# Altium schematic sheet [04] - ETHERNET.SchDoc
size A2
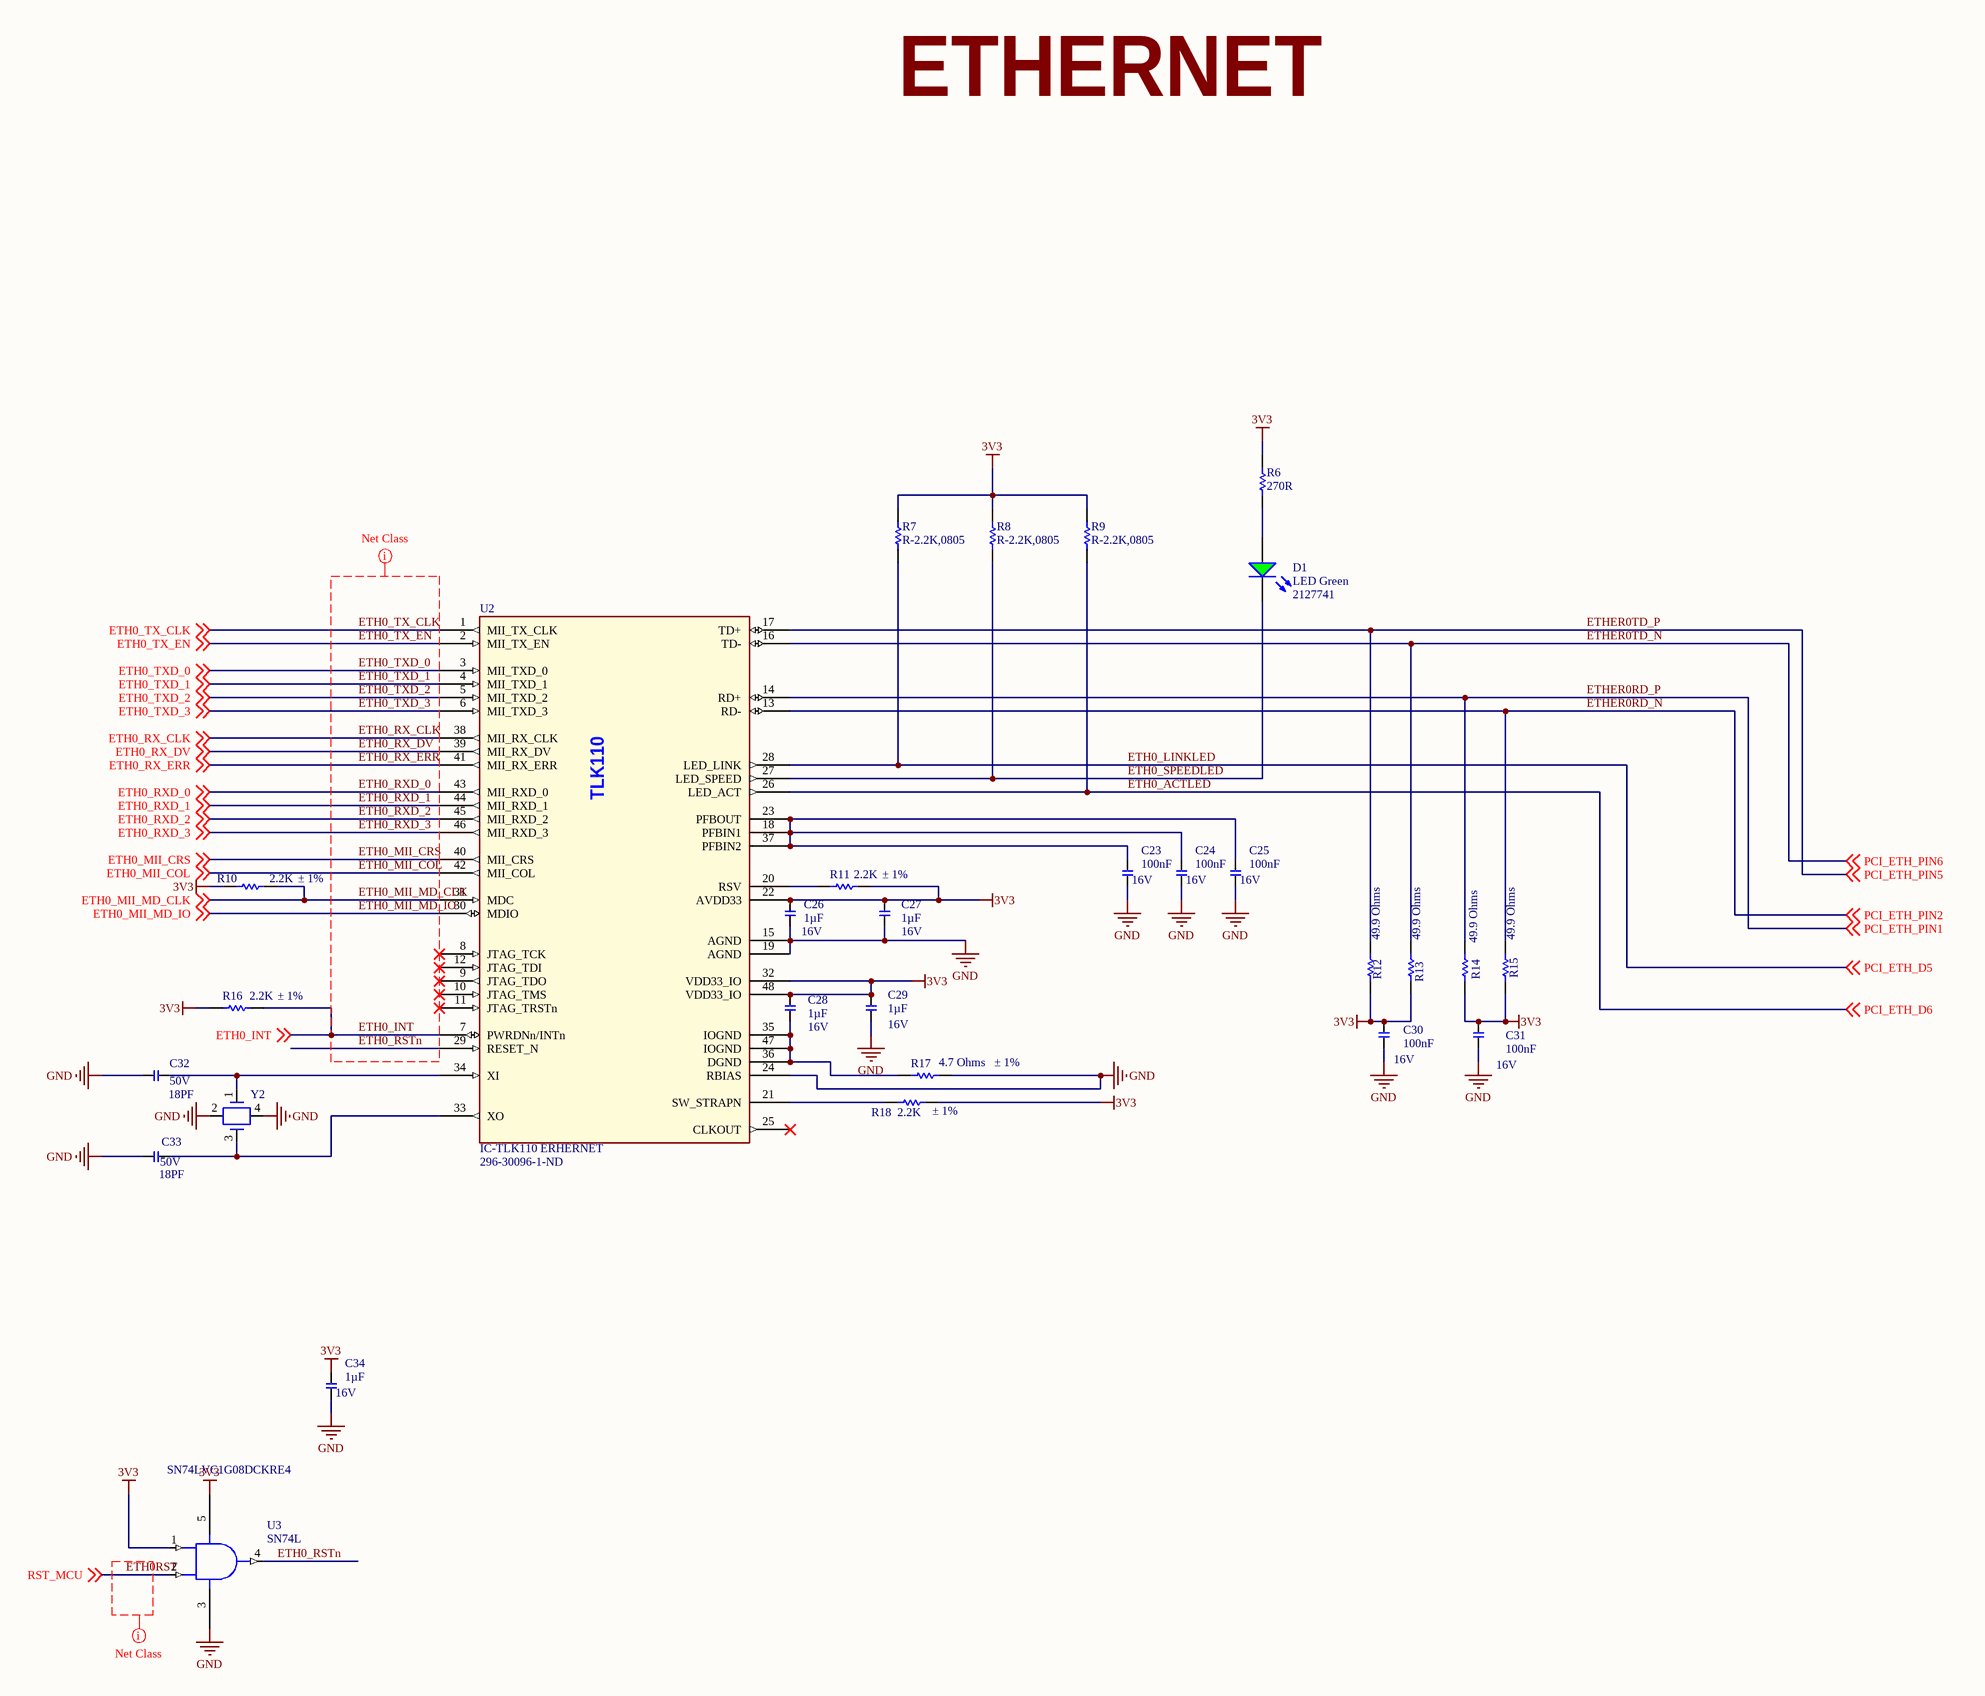
[diagram p0: [04] - ETHERNET.SchDoc]

## Parts
C23  100nF  Voltage - Rated: 16V  [C0805]
C24  100nF  Voltage - Rated: 16V  [C0805]
C25  100nF  Voltage - Rated: 16V  [C0805]
C26  1µF  Voltage - Rated: 16V  [C0805]
C27  1µF  Voltage - Rated: 16V  [C0805]
C28  1µF  Voltage - Rated: 16V  [C0805]
C29  1µF  Voltage - Rated: 16V  [C0805]
C30  100nF  Voltage - Rated: 16V  [C0805]
C31  100nF  Voltage - Rated: 16V  [C0805]
C32  18PF  voltage_rating_dc: 50V  [C0805]
C33  18PF  voltage_rating_dc: 50V  [C0805]
C34  1µF  Voltage - Rated: 16V  [C0805]
D1  LED Green  Supplier Part Number 1: 2127741  [LED_0805]
R6  270R  [R0805]
R7  R-2.2K,0805  [R0805]
R8  R-2.2K,0805  [R0805]
R9  R-2.2K,0805  [R0805]
R10  2.2K  Resistance Tolerance: ± 1%  [R0805]
R11  2.2K  Resistance Tolerance: ± 1%  [R0805]
R12  49.9 Ohms  [R0805]
R13  49.9 Ohms  [R0805]
R14  49.9 Ohms  [R0805]
R15  49.9 Ohms  [R0805]
R16  2.2K  Resistance Tolerance: ± 1%  [R0805]
R17  4.7 Ohms  Resistance Tolerance: ± 1%  [R0805]
R18  2.2K  Resistance Tolerance: ± 1%  [R0805]
U2  IC-TLK110 ERHERNET  Supplier Part Number 1: 296-30096-1-ND  [STM-LQFP48_M]
U3  SN74L  Manufacturer Part Number: SN74LVC1G08DCKRE4  [sm-so-sc70-5]
Y2  25MHz  [ABM8G]  (value not drawn)

## Nets
3V3: C26.2 C27.2 C28.2 C29.2 C30.2 C31.2 C34.2 R6.2 R7.2 R8.2 R9.2 R10.1 R11.2 R12.1 R13.1 R14.1 R15.1 R16.1 R18.2 U2.22(AVDD33) U2.32(VDD33_IO) U2.48(VDD33_IO) U3.1(A) U3.5(VCC)
GND: C23.1 C24.1 C25.1 C26.1 C27.1 C29.1 C30.1 C31.1 C32.1 C33.1 C34.1 R17.1 U2.15(AGND) U2.19(AGND) U2.24(RBIAS) U3.3(GND) Y2.2 Y2.4
ETH0_ACTLED: R9.1 U2.26(LED_ACT) ; off-sheet PCI_ETH_D6  [also labelled PCI_ETH_D6]
ETH0_INT: R16.2 U2.7(PWRDNn/INTn) ; off-sheet ETH0_INT
ETH0_LINKLED: R7.1 U2.28(LED_LINK) ; off-sheet PCI_ETH_D5  [also labelled PCI_ETH_D5]
ETH0_MII_COL: U2.42(MII_COL) ; off-sheet ETH0_MII_COL
ETH0_MII_CRS: U2.40(MII_CRS) ; off-sheet ETH0_MII_CRS
ETH0_MII_MD_CLK: R10.2 U2.31(MDC) ; off-sheet ETH0_MII_MD_CLK
ETH0_MII_MD_IO: U2.30(MDIO) ; off-sheet ETH0_MII_MD_IO
ETH0_RSTn: U2.29(RESET_N) U3.4(Y)
ETH0_RX_CLK: U2.38(MII_RX_CLK) ; off-sheet ETH0_RX_CLK
ETH0_RX_DV: U2.39(MII_RX_DV) ; off-sheet ETH0_RX_DV
ETH0_RX_ERR: U2.41(MII_RX_ERR) ; off-sheet ETH0_RX_ERR
ETH0_RXD_0: U2.43(MII_RXD_0) ; off-sheet ETH0_RXD_0
ETH0_RXD_1: U2.44(MII_RXD_1) ; off-sheet ETH0_RXD_1
ETH0_RXD_2: U2.45(MII_RXD_2) ; off-sheet ETH0_RXD_2
ETH0_RXD_3: U2.46(MII_RXD_3) ; off-sheet ETH0_RXD_3
ETH0_SPEEDLED: D1.1(K) R8.1 U2.27(LED_SPEED)
ETH0_TX_CLK: U2.1(MII_TX_CLK) ; off-sheet ETH0_TX_CLK
ETH0_TX_EN: U2.2(MII_TX_EN) ; off-sheet ETH0_TX_EN
ETH0_TXD_0: U2.3(MII_TXD_0) ; off-sheet ETH0_TXD_0
ETH0_TXD_1: U2.4(MII_TXD_1) ; off-sheet ETH0_TXD_1
ETH0_TXD_2: U2.5(MII_TXD_2) ; off-sheet ETH0_TXD_2
ETH0_TXD_3: U2.6(MII_TXD_3) ; off-sheet ETH0_TXD_3
ETH0RST: U3.2(B) ; off-sheet RST_MCU  [also labelled RST_MCU]
ETHER0RD_N: R15.2 U2.13(RD-) ; off-sheet PCI_ETH_PIN2  [also labelled PCI_ETH_PIN2]
ETHER0RD_P: R14.2 U2.14(RD+) ; off-sheet PCI_ETH_PIN1  [also labelled PCI_ETH_PIN1]
ETHER0TD_N: R13.2 U2.16(TD-) ; off-sheet PCI_ETH_PIN6  [also labelled PCI_ETH_PIN6]
ETHER0TD_P: R12.2 U2.17(TD+) ; off-sheet PCI_ETH_PIN5  [also labelled PCI_ETH_PIN5]
NetC23_2: C23.2 C24.2 C25.2 U2.18(PFBIN1) U2.23(PFBOUT) U2.37(PFBIN2)
NetC28_1: C28.1 R17.2 U2.35(IOGND) U2.36(DGND) U2.47(IOGND)
NetC32_2: C32.2 U2.34(XI) Y2.1
NetC33_2: C33.2 U2.33(XO) Y2.3
NetD1_2: D1.2(A) R6.1
NetR11_1: R11.1 U2.20(RSV)
NetR18_1: R18.1 U2.21(SW_STRAPN)

Not connected (* = marked no-connect by the designer): U2 8(JTAG_TCK)* 9(JTAG_TDO)* 10(JTAG_TMS)* 11(JTAG_TRSTn)* 12(JTAG_TDI)* 25(CLKOUT)*

## Layout directives
net class ETHERNET: ETH0_INT, ETH0_MII_COL, ETH0_MII_CRS, ETH0_MII_MD_CLK, ETH0_MII_MD_IO, ETH0_RSTn, ETH0_RX_CLK, ETH0_RX_DV, ETH0_RX_ERR, ETH0_RXD_0, ETH0_RXD_1, ETH0_RXD_2, ETH0_RXD_3, ETH0_TX_CLK, ETH0_TX_EN, ETH0_TXD_0, ETH0_TXD_1, ETH0_TXD_2, ETH0_TXD_3, ETH0RST

## Notes on the sheet
- ETHERNET
- (in symbol IC-TLK110 ERHERNET) TLK110

## Library data of the parts
C23-C25 C30 C31 = C-100NF,16V,0805: AVX - 0805YA103JAT2A - CAP, MLCC, C0G/NP0, 10NF, 16V, 0805; Tolerance: ±5%; Temperature Coefficient: C0G, NP0; Supplier 1: Digi-Key; Manufacturer: AVX; Manufacturer Part Number: 0805YA103JAT2A; RoHS: YES; Stock 1: 28062; Pricing 1: 1=0.29, 10=0.204, 25=0.1668, 50=0.1424, 100=0.1221, 250=0.10176, 500=0.09158, 1000=0.07733 (USD); Capacitance: 100nF; Packaging: Cut Tape (CT); ComponentLink1URL: http://www.avx.com/docs/Catalogs/ccog.pdf; ComponentLink1Description: http://www.avx.com/docs/Catalogs/ccog.pdf; Supplier Part Number 1: 478-1334-1-ND; ComponentLink2URL: http://www.farnell.com/datasheets/1825494.pdf; ComponentLink2Description: http://www.farnell.com/datasheets/1825494.pdf; Category: Capacitors; Mounting Type: Surface Mount, MLCC; Operating Temperature: -55°C ~ 125°C; Applications: General Purpose; Ratings: -; Package / Case: 0805 (2012 Metric); Size / Dimension: 0.079" L x 0.049" W (2.01mm x 1.25mm); Height - Seated (Max): -; Thickness (Max): 0.037" (0.94mm); Lead Spacing: -; Features: -; Lead Style: -; ComponentLink3URL: http://datasheets.avx.com/C0GNP0-Dielectric.pdf; ComponentLink3Description: http://datasheets.avx.com/C0GNP0-Dielectric.pdf
C26-C29 C34 = C-1UF,16V,0805: AVX - 0805YC105KAT2A - CAP, MLCC, X7R, 1UF, 16V, 0805; Manufacturer: AVX Corporation; Tolerance: ±10%; Supplier 1: Digi-Key; Manufacturer Part Number: 0805YC105KAT2A; RoHS: RoHS Compliant; Stock 1: 76930; Pricing 1: 1=0.19, 10=0.132, 25=0.0964, 50=0.075, 100=0.0622, 250=0.05148, 500=0.04362, 1000=0.03611 (USD); ComponentLink1URL: http://datasheets.avx.com/X7RDielectric.pdf; ComponentLink1Description: http://datasheets.avx.com/X7RDielectric.pdf; Supplier Part Number 1: 478-5034-1-ND; Category: Capacitors; Packaging: Cut Tape (CT); Temperature Coefficient: X7R; Mounting Type: Surface Mount, MLCC; Operating Temperature: -55°C ~ 125°C; Applications: General Purpose; Ratings: -; Package / Case: 0805 (2012 Metric); Size / Dimension: 0.079" L x 0.049" W (2.01mm x 1.25mm); Height - Seated (Max): -; Thickness (Max): 0.055" (1.40mm); Lead Spacing: -; Features: -; Lead Style: -; Capacitance: 1µF
C32 C33 = C-18PF,50V,0805: MULTICOMP - MC0805N180J500CT - CAP, MLCC, C0G/NP0, 18PF, 50V,0805, REEL; capacitance_tolerance: ±5%; pin_count: 2; Supplier 1: Octopart; Manufacturer: Multicomp; Manufacturer Part Number: MC0805N180J500CT; Pricing 1: 1=0.11400, 10=0.07300, 50=0.04100, 100=0.03200, 250=0.02600, 500=0.02200, 1000=0.01800 (USD); capacitance: 18PF; ComponentLink1URL: http://datasheet.octopart.com/MC0805N180J500CT-Multicomp-datasheet-16478625.pdf; ComponentLink1Description: http://datasheet.octopart.com/MC0805N180J500CT-Multicomp-datasheet-16478625.pdf; Supplier Part Number 1: Newark - 06R4039; Stock 1: 3187; reach_svhc_compliance: No SVHC; rohs_status: Compliant; dielectric_characteristic: C0G/NP0; Octopart Url: http://octopart.com/mc0805n180j500ct-multicomp-10529169; Seller Landing  Url: https://octopart-clicks.com/click/track?country=TR&ak=8157f166&sig=03c9fd1&sid=2402&ppid=10529169&vpid=17760821&ct=offers; OctopartID: 811748bd0de05ed0; ComponentLink2URL: http://datasheet.octopart.com/MC0805N180J500CT-Multicomp-datasheet-22150886.pdf; ComponentLink2Description: http://datasheet.octopart.com/MC0805N180J500CT-Multicomp-datasheet-22150886.pdf; ComponentLink3URL: http://datasheet.octopart.com/MC0805N180J500CT-Multicomp-datasheet-8445804.pdf; ComponentLink3Description: http://datasheet.octopart.com/MC0805N180J500CT-Multicomp-datasheet-8445804.pdf; ComponentLink4URL: http://datasheet.octopart.com/MC0805N180J500CT-Multicomp-datasheet-34215986.pdf; ComponentLink4Description: http://datasheet.octopart.com/MC0805N180J500CT-Multicomp-datasheet-34215986.pdf; ComponentLink5URL: http://datasheet.octopart.com/MC0805N180J500CT-Multicomp-datasheet-26590290.pdf; ComponentLink5Description: http://datasheet.octopart.com/MC0805N180J500CT-Multicomp-datasheet-26590290.pdf; ComponentLink6URL: http://datasheet.octopart.com/MC0805N180J500CT-Multicomp-datasheet-15500401.pdf; ComponentLink6Description: http://datasheet.octopart.com/MC0805N180J500CT-Multicomp-datasheet-15500401.pdf; ComponentLink7URL: http://datasheet.octopart.com/MC0805N180J500CT-Multicomp-datasheet-10838970.pdf; ComponentLink7Description: http://datasheet.octopart.com/MC0805N180J500CT-Multicomp-datasheet-10838970.pdf
D1 = LED-Green SMD 20mA 2V 0805: LED Green SMD 20mA 2V 0805; TIIntPartnumber: 1F0008; MfrNum: 598-8170-107F; Mfr: Dialight; PartName: LEDGreen2x1.5; Cost10K: 0.052; Cost100: 0.081; Vendor: Digikey; DescriptiveText: LED Green SMD 20mA 2V 0805; Descriptive_Text: LED Green SMD 20mA 2V 0805; Supplier 1: Farnell
R6 = R-270R,0805: TE CONNECTIVITY / NEOHM 270R Thin Film; Manufacturer Part Number: CPF0805B270RE1; Product Range: TE CONNECTIVITY - CPF Series; Resistance: 270 Ohms; Power Rating: 100; Resistance Tolerance: ± 0.1%; Resistor Case Style: 0805 [2012 Metric]; Temperature Coefficient: ± 25; Voltage Rating: 200; External Depth: 0.5; External Length / Height: 2; External Width: 1.25; Resistor Mounting: SMD; Supplier 1: Farnell; Manufacturer: TE CONNECTIVITY / NEOHM; RoHS: YES; Stock 1: 755; Pricing 1: 10=0,43, 50=0,34, 100=0,32, 500=0,27, 1000=0,24 (EUR); Resistor Element Material: Thin Film; Packaging: Cut Tape; MSL: -; No. of Pins: 2; Operating Temperature Max: 155; Operating Temperature Min: -55; Operating Temperature Range: -55°C to +155; Series: CPF<!--FANDB--><div class="features-and-benefits-container"></div>; ComponentLink1URL: http://www.tycoelectronics.com/commerce/DocumentDelivery/DDEController?Action=srchrtrv&DocNm=1614884&DocType=Customer+Drawing&DocLang=English; ComponentLink1Description: http://www.tycoelectronics.com/commerce/DocumentDelivery/DDEController?Action=srchrtrv&DocNm=1614884&DocType=Customer+Drawing&DocLang=English; ComponentLink2URL: http://www.tycoelectronics.com/commerce/DocumentDelivery/DDEController?Action=srchrtrv&DocNm=1773200&DocType=Data+Sheet&DocLang=English; ComponentLink2Description: http://www.tycoelectronics.com/commerce/DocumentDelivery/DDEController?Action=srchrtrv&DocNm=1773200&DocType=Data+Sheet&DocLang=English; Supplier Part Number 1: 1697424
R7-R11 R16 R18 = R-2.2K,0805: PANASONIC - ERJP06F2201V - RESISTOR, THICK FILM, 2.2 KOHM, 0.5W, 1%; Product Range: PANASONIC - ERJ Series; Resistance: 2.2K Ohms; Power Rating: 500; Resistor Case Style: 0805 [2012 Metric]; Temperature Coefficient: ± 100; Voltage Rating: 400; SVHC: No SVHC (16-Dec-2013); External Depth: 1.25; External Length / Height: 0.6; External Width: 2; Overload Voltage: 600; Reel Quantity: 5000; Resistor Mounting: SMD; Supplier 1: Farnell; Manufacturer: PANASONIC; Manufacturer Part Number: ERJP06F2201V; RoHS: YES; Stock 1: 750; Pricing 1: 25=0,127, 100=0,105, 500=0,0858, 1000=0,065, 5000=0,0624 (EUR); Resistor Element Material: Thick Film; Packaging: Cut Tape; MSL: -; No. of Pins: 2; Operating Temperature Max: 155; Operating Temperature Min: -55; Operating Temperature Range: -55°C to +155; Series: ERJP<!--FANDB--><div class="features-and-benefits-container"></div>; ComponentLink1URL: http://www.farnell.com/datasheets/1801181.pdf; ComponentLink1Description: http://www.farnell.com/datasheets/1801181.pdf; ComponentLink2URL: http://www.farnell.com/datasheets/1718548.pdf; ComponentLink2Description: http://www.farnell.com/datasheets/1718548.pdf; ComponentLink3URL: http://www.farnell.com/cad/1697897.zip; ComponentLink3Description: http://www.farnell.com/cad/1697897.zip; Supplier Part Number 1: 1750759
  R7-R9: Resistance Tolerance: ± 1%
R12-R15 = R-49.9R,0805: PANASONIC - ERJP06F49R9V - RESISTOR, THICK FILM, 49.9 OHM, 0.5W, 1%; Product Range: PANASONIC - ERJ Series; Power Rating: 500; Resistor Case Style: 0805 [2012 Metric]; Temperature Coefficient: ± 100; Voltage Rating: 400; SVHC: No SVHC (16-Dec-2013; Supplier 1: Farnell; Manufacturer: PANASONIC; Manufacturer Part Number: ERJP06F49R9V; RoHS: YES; Stock 1: 3370; Pricing 1: 25=0,078, 100=0,0728, 500=0,0429, 1000=0,0312, 5000=0,0234 (EUR); Resistance: 49.9 Ohms; Resistance Tolerance: ± 1%; Resistor Element Material: Thick Film; Packaging: Cut Tape; MSL: -; ComponentLink1URL: http://www.farnell.com/datasheets/1801181.pdf; ComponentLink1Description: http://www.farnell.com/datasheets/1801181.pdf; ComponentLink2URL: http://www.farnell.com/datasheets/1718548.pdf; ComponentLink2Description: http://www.farnell.com/datasheets/1718548.pdf; Supplier Part Number 1: 2312274
R17 = R-4.7K,0805: BOURNS - CR0805-FX-4701GLF - RESISTOR, 4.7K, 0.125W, 1%; Product Range: BOURNS - CR Series; Power Rating: 125; Resistor Case Style: 0805 [2012 Metric]; Resistor Element Material: Thick Film; Temperature Coefficient: ± 100; Voltage Rating: 150; SVHC: No SVHC (16-Jun-2014); Resistor Mounting: SMD<!--FANDB--><div class="features-and-benefits-container"></div>; Supplier 1: Farnell; Manufacturer: BOURNS; Manufacturer Part Number: CR0805-FX-4701GLF; RoHS: YES; Stock 1: 20050; Pricing 1: 50=0,0312, 250=0,0247, 1000=0,0234, 5000=0,0156, 10000=0,0143 (EUR); Resistance: 4.7 Ohms; Packaging: Cut Tape; MSL: MSL 1 - Unlimited; ComponentLink1URL: http://www.farnell.com/datasheets/1845293.pdf; ComponentLink1Description: http://www.farnell.com/datasheets/1845293.pdf; Supplier Part Number 1: 2008383
U2 = IC-TLK110 ERHERNET: IC ETHERNET PHY 10/100 48LQFP; Manufacturer: Texas Instruments; Manufacturer Part Number: TLK110PTR; Protocol: MII, RMII; Number of Drivers/Receivers: 1/1; Duplex: Full; Voltage - Supply: 3 V ~ 3.6 V; Supplier 1: Digi-Key; RoHS: RoHS Compliant; Category: Integrated Circuits (ICs); Stock 1: 1906; Pricing 1: 1=6.63, 10=5.954, 100=4.8843, 500=4.1553, 1000=3.0375 (USD); Packaging: Cut Tape (CT); Type: Transceiver; Receiver Hysteresis: -; Data Rate: -; Operating Temperature: -40°C ~ 85°C; Mounting Type: Surface Mount; Package / Case: 48-LQFP; Supplier Device Package: 48-LQFP (7x7); ComponentLink1URL: http://www.ti.com/lit/ds/symlink/tlk110.pdf; ComponentLink1Description: http://www.ti.com/lit/ds/symlink/tlk110.pdf
U3 = IC-SN74LVC1G08DCKRE4- AND 1 CH: IC GATE AND 1CH 2-INP SC-70-5; Manufacturer: Texas Instruments; Logic Type: AND Gate; Number of Circuits: 1; Number of Inputs: 2; Voltage - Supply: 1.65 V ~ 5.5 V; Current - Quiescent (Max): 10µA; Current - Output High, Low: 32mA, 32mA; Max Propagation Delay @ V, Max CL: 4ns @ 5V, 50pF; Supplier 1: Digi-Key; Supplier Part Number 1: 296-35940-6-ND; RoHS: RoHS Compliant; Category: Integrated Circuits (ICs); Stock 1: 8395; Pricing 1: 1=0.42, 10=0.315, 100=0.196, 500=0.134, 1000=0.103 (USD); Packaging: Digi-Reel®; Features: -; Logic Level - Low: -; Logic Level - High: -; Operating Temperature: -40°C ~ 125°C; Mounting Type: Surface Mount; Supplier Device Package: SC-70-5; Package / Case: 5-TSSOP, SC-70-5, SOT-353; ComponentLink1URL: http://www.ti.com/lit/ds/symlink/sn74lvc1g08.pdf; ComponentLink1Description: http://www.ti.com/lit/ds/symlink/sn74lvc1g08.pdf
Y2 = OSC-Crystal25MHz-R: RALTRON - RH100-25.000-18-F-3030-EXT - CRYSTAL, 25MHZ, 18PF, 3.2MM X 2.5MM; Product Range: RH100 Series; Frequency Nom: 25; Frequency Stability + / -: 30; Crystal Case: SMD, 3.2mm x 2.5; Load Capacitance: 18; SVHC: No SVHC (17-Dec-2015); Supplier 1: Farnell; Manufacturer: RALTRON; Manufacturer Part Number: RH100-25.000-18-F-3030-EXT; RoHS: YES; Pricing 1: 1=0.81, 5=0.75, 10=0.68, 20=0.61, 40=0.58, 100=0.54, 500=0.529, 1000=0.518 (GBP); Frequency Tolerance + / -: 30; Operating Temperature Min: -40; Operating Temperature Max: 85; MSL: MSL 1 - Unlimited<!--FANDB--><div class="features-and-benefits-container"></div>; ComponentLink1URL: http://www.farnell.com/datasheets/1998832.pdf; ComponentLink1Description: http://www.farnell.com/datasheets/1998832.pdf; Supplier Part Number 1: 2509084RL